# Altium schematic sheet Relay1_Block.SchDoc
size A4; CheckedBy: CT-Energys; Author: CT-Energys; CompanyName: HTD COMPANY LIMITED; DrawnBy: CHITOAN; Engineer: CHITOAN; Organization: Altium Limited; Address1: HO CHI MINH CITY; Address2: VIETNAM
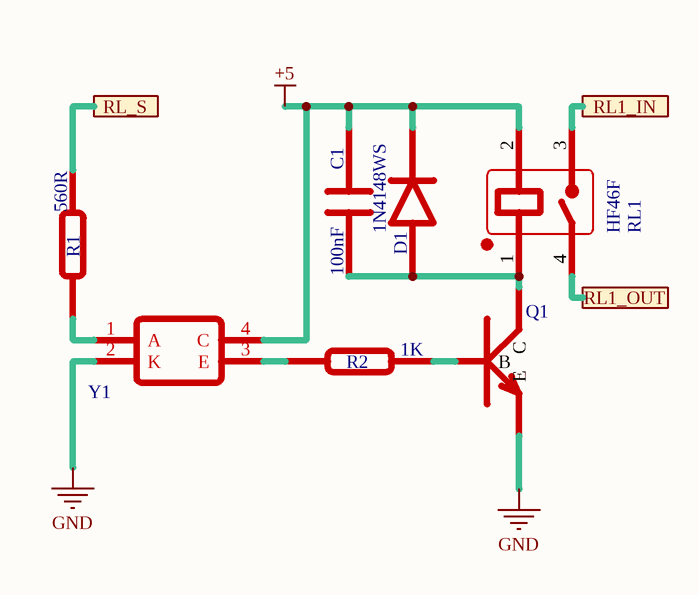
[diagram p0: Relay1_Block.SchDoc]

## Parts
C1  100nF  [C0805]
D1  1N4148WS  [SMA]
Q1  S8050  [SOT-23]  (value not drawn)
R1  560R  [R0603]
R2  1K  [R0603]
RL1  HF46F  [HF-46-X]
Y1  PHOTOCOUPLER  [SOP-4]  (value not drawn)

## Ports
RL1_IN, RL1_OUT, RL_S

## Nets
+5: C1.2 D1.K RL1.2 Y1.4(C)
GND: Q1.2(E) Y1.2(K)
RL1_IN: RL1.3 ; port RL1_IN
RL1_OUT: RL1.4 ; port RL1_OUT
RL_S: R1.1 ; port RL_S
NetC1_1: C1.1 D1.A Q1.3(C) RL1.1
NetQ1_1: Q1.1(B) R2.1
NetR1_2: R1.2 Y1.1(A)
NetR2_2: R2.2 Y1.3(E)

## Notes on the sheet
- Title
- Size:
- Date:
- A4
- Number:
- Time:
- Revision:
- Design by:
- Company:
- File:

## Library data of the parts
C1 = CAP-CER: Ceramic Capacitor
D1 = 1N4148WS: Small Signal Diode
Q1 = S8050: NPN Transistors 0.5A Collector to Emitter 25V
R1 R2 = Resistor
RL1 = HF46F: Relay 4 Pin; ComponentLink1Description: HF-46F; ComponentLink1URL: https://source.hongfa.com/pdf/web/viewer.html?file=/Uploads/Product/PDF/HF46F_en.pdf
Y1 = PC817: Photo-Coupler; ComponentLink1Description: PC817; ComponentLink1URL: https://www.socle-tech.com/doc/IC%20Channel%20Product/Optoelectronic%20Components/Photocoupler/PC8171_NIP1B_ED-16P023.pdf